# EAGLE design switch_hat_v3 (EAGLE 7.5.0)
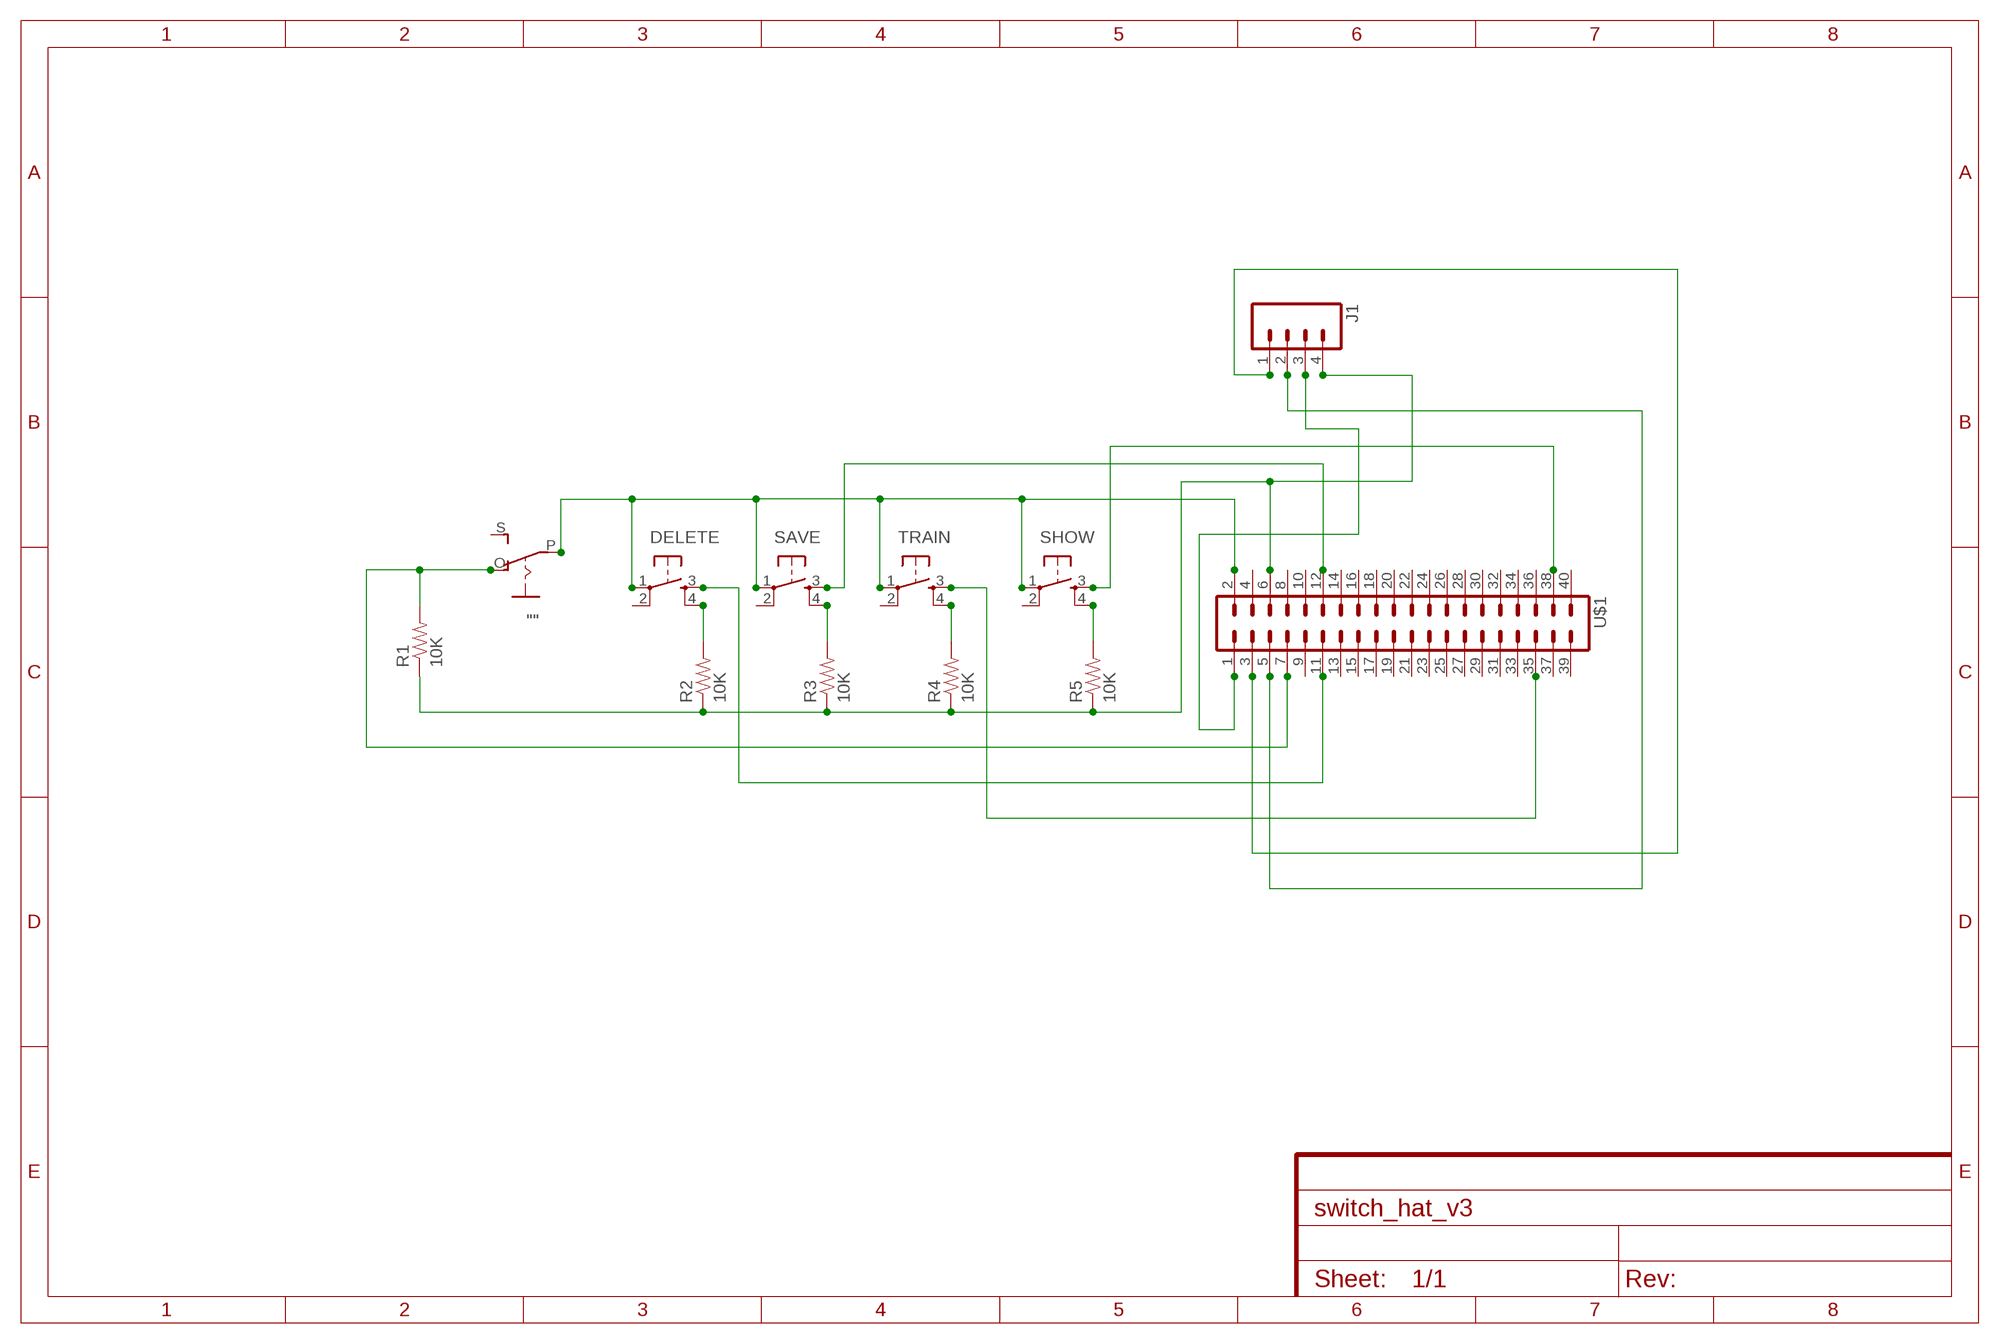
[diagram p0: schematic, sheet 1]

## Parts
""  EG1218S  [EG1218]
DELETE  TAC_SWITCHPTH  [TACTILE-PTH]
J1  M04LOCK  [1X04_LOCK]
R1  10K  RESISTOR0805-RES  [0805]
R2  10K  RESISTOR0805-RES  [0805]
R3  10K  RESISTOR0805-RES  [0805]
R4  10K  RESISTOR0805-RES  [0805]
R5  10K  RESISTOR0805-RES  [0805]
SAVE  TAC_SWITCHPTH  [TACTILE-PTH]
SHOW  TAC_SWITCHPTH  [TACTILE-PTH]
TRAIN  TAC_SWITCHPTH  [TACTILE-PTH]
U$1  PIZERO_THROUGH_HOLE  [PIZERO_THOUGH_HOLE]

## Nets
N$1: DELETE.4 R2.2
N$2: R3.2 SAVE.4
N$3: R4.2 TRAIN.4
N$4: R5.2 SHOW.4
N$5: J1.4 R1.1 R2.1 R3.1 R4.1 R5.1 U$1.6
N$6: DELETE.3 U$1.11
N$7: SAVE.3 U$1.12
N$8: J1.2 U$1.5
N$9: TRAIN.3 U$1.35
N$10: SHOW.3 U$1.38
N$11: J1.3 U$1.1
N$12: "".O R1.2 U$1.7
N$13: J1.1 U$1.3
VOLT: "".P DELETE.1 SAVE.1 SHOW.1 TRAIN.1 U$1.2
Unconnected: "".S DELETE.2 SAVE.2 SHOW.2 TRAIN.2 U$1.4 U$1.8 U$1.9 U$1.10 U$1.13 U$1.14 U$1.15 U$1.16 U$1.17 U$1.18 U$1.19 U$1.20 U$1.21 U$1.22 U$1.23 U$1.24 U$1.25 U$1.26 U$1.27 U$1.28 U$1.29 U$1.30 U$1.31 U$1.32 U$1.33 U$1.34 U$1.36 U$1.37 U$1.39 U$1.40

## Library data of the parts
"" = adafruit:EG1218: SLIDING SWITCH 0.1" spacing through hole, vertical SPDT slide switch http://www.ladyada.net/library/pcb/eaglelibrary.html
DELETE SAVE SHOW TRAIN = SparkFun-Retired:TAC_SWITCH: Momentary Switch Button commonly used for reset or general input. Spark Fun Electronics SKU : COM-00097 SMT- SWCH-08247
J1 = SparkFun-Connectors:M04: Header 4 Standard 4-pin 0.1" header. Use with straight break away headers (SKU : PRT-00116), right angle break away headers (PRT-00553), swiss pins (PRT-00743), machine pins (PRT-00117), and female headers (PRT-00115). Molex polarized connector foot print use with SKU : PRT-08231 with associated crimp pins and housings. 1MM SMD Version SKU: PRT-10208; PROD_ID: CONN-09696
R1-R5 = SparkFun-Passives:RESISTOR: Resistor Basic schematic elements and footprints for 0603, 1206, and PTH resistors.
U$1 = pizero:PIZERO_THROUGH_HOLE

## Board
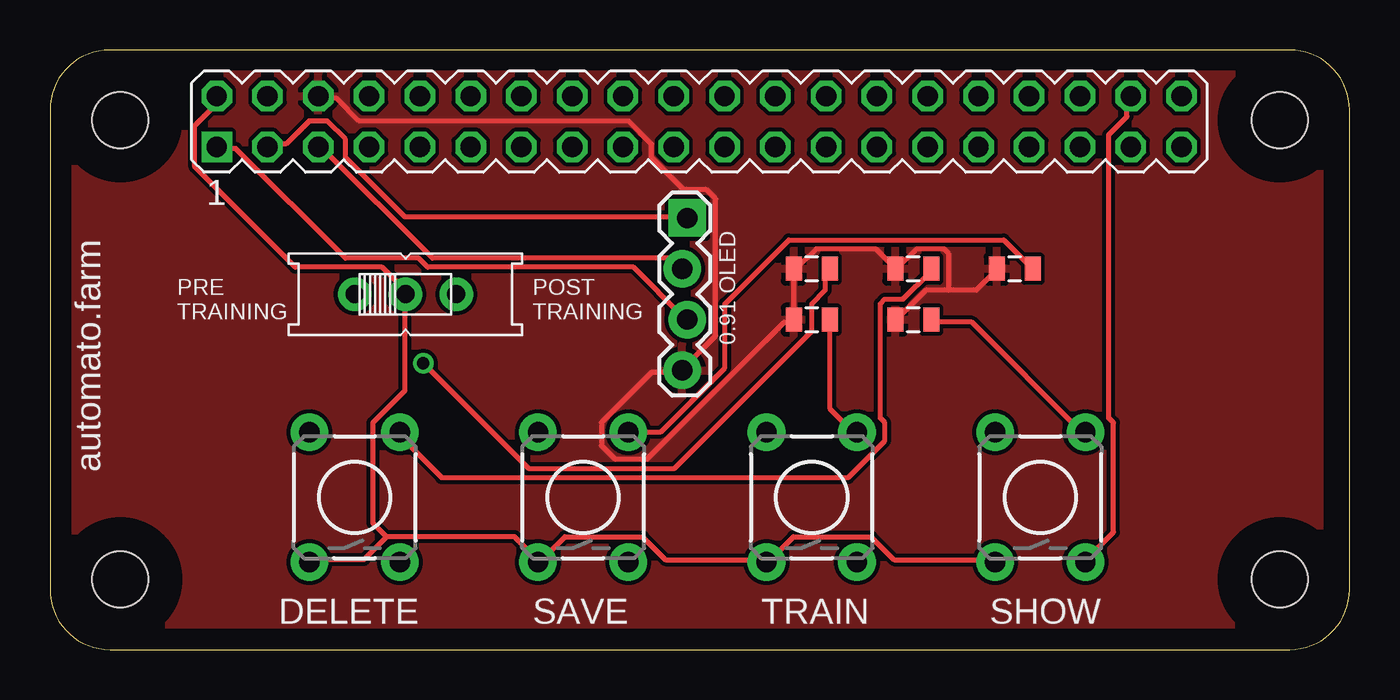
[diagram p1: board, top side]
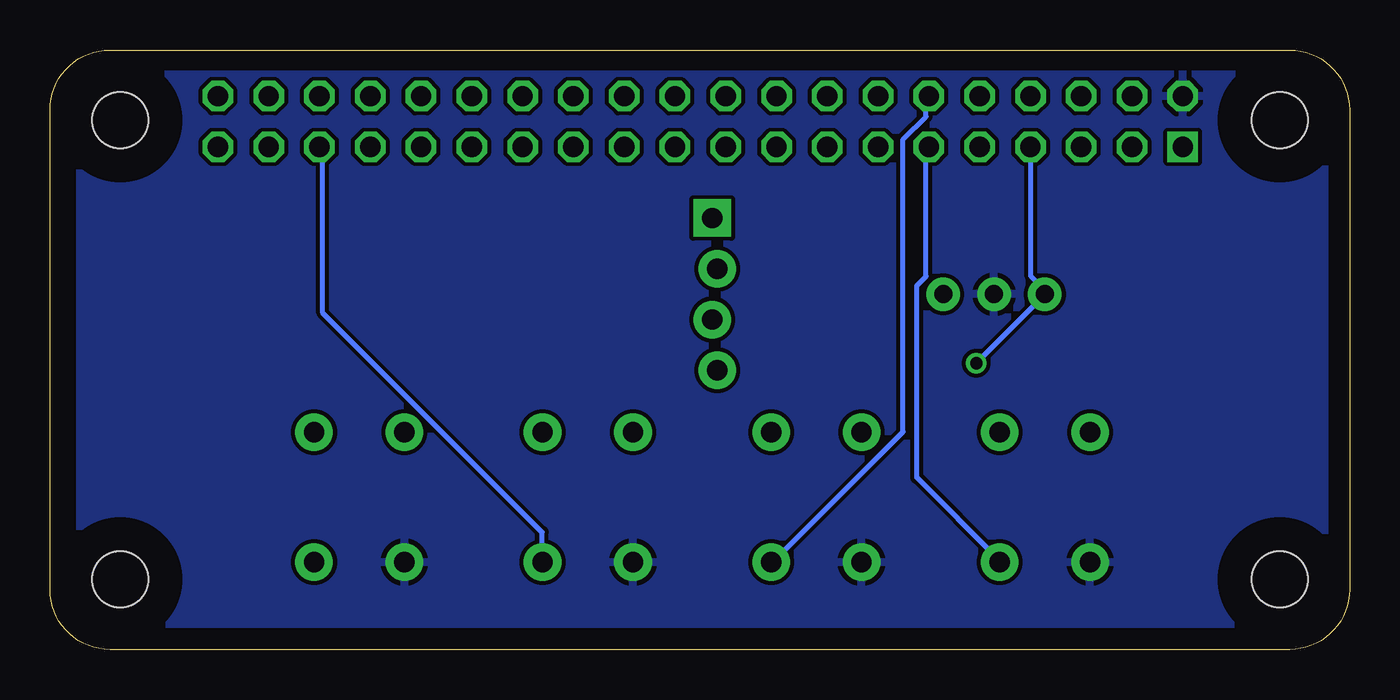
[diagram p2: board, bottom side, seen from below]

Size 65 x 30 mm. Coordinates in mm from the lower left corner, seen from the top.
Copper layers (1*16): Top 0.035mm / dielectric 1.5mm / Bottom 0.035mm
Design rules "default": minimum track width 10mil, minimum drill 24mil, track to track 8mil, track to pad 8mil, pad to pad 8mil, via to via 8mil, smd to smd 8mil, copper to edge 40mil, drill to drill 8mil, minimum pad ring 10mil, minimum via ring 8mil, stop-mask expansion 4mil, vias tented up to drill 0mil, thermal gap 10mil

### Footprints (pad centres in the part's own frame; a part is rotated, then mirrored left to right if it is on the bottom)
EG1218 = drill 0.9 pad 1.676: O -2.54,0; P 0,0; S 2.54,0
TACTILE-PTH = drill 1.016 pad 1.88: 1 -3.251,2.261; 2 3.251,2.261; 3 -3.251,-2.261; 4 3.251,-2.261
1X04_LOCK = drill 1.016 pad 1.88 square: 1 0,0.127 | drill 1.016 pad 1.88: 2 2.54,-0.127; 3 5.08,0.127; 4 7.62,-0.127
0805 = smd 0.8 x 1.2: 1 -0.9,0; 2 0.9,0
PIZERO_THOUGH_HOLE = drill 1.016 square: 1 8.34,25.15 | drill 1.016 octagon: 2 8.34,27.69; 3 10.88,25.15; 4 10.88,27.69; 5 13.42,25.15; 6 13.42,27.69; 7 15.96,25.15; 8 15.96,27.69; 9 18.5,25.15; 10 18.5,27.69; 11 21.04,25.15; 12 21.04,27.69; 13 23.58,25.15; 14 23.58,27.69; 15 26.12,25.15; 16 26.12,27.69; 17 28.66,25.15; 18 28.66,27.69; 19 31.2,25.15; 20 31.2,27.69; 21 33.74,25.15; 22 33.74,27.69; 23 36.28,25.15; 24 36.28,27.69; 25 38.82,25.15; 26 38.82,27.69; 27 41.36,25.15; 28 41.36,27.69; 29 43.9,25.15; 30 43.9,27.69; 31 46.44,25.15; 32 46.44,27.69; 33 48.98,25.15; 34 48.98,27.69; 35 51.52,25.15; 36 51.52,27.69; 37 54.06,25.15; 38 54.06,27.69; 39 56.6,25.15; 40 56.6,27.69 | hole 2.8: 3.5,3.5; 3.5,26.5; 61.5,26.5; 61.5,3.5

### Placement (x,y rotation side)
""  17.78,17.78 0 top
DELETE  15.24,7.62 90 top
J1  31.75,21.59 270 top
R1  38.1,19.05 0 top
R2  43.18,19.05 0 top
R3  48.26,19.05 0 top
R4  38.1,16.51 0 top
R5  43.18,16.51 0 top
SAVE  26.67,7.62 90 top
SHOW  49.53,7.62 90 top
TRAIN  38.1,7.62 90 top
U$1  0,0 0 top

### Tracks (layer width: path | path; a pad name or v marks a point on that pad's centre or on a via)
N$1
  Top 0.254: R2.2 44.04,18.9 42.67,17.53 41.76,17.53 41.53,17.3 41.53,11.58 41.76,11.35 41.76,10.44 39.93,8.61 19.58,8.61 17.53,10.67 DELETE.4
N$2
  Top 0.254: R3.2 49.07,19.13 47.7,20.5 36.96,20.5 33.76,17.3 33.76,14.1 30.56,10.9 28.96,10.9 SAVE.4
N$3
  Top 0.254: R4.2 39.01,16.38 39.01,12.04 40.16,10.9 TRAIN.4
N$4
  Top 0.254: R5.2 44.27,16.38 46.1,16.38 51.59,10.9 SHOW.4
N$5
  Top 0.254: 44.96,17.98 46.33,17.98 47.24,18.9 R3.1 | 44.96,17.98 43.82,17.98 42.44,16.61 R5.1 | 44.96,17.98 44.96,19.81 44.73,20.04 43.36,20.04 42.44,19.13 R2.1 42.22,19.13 41.3,20.04 38.33,20.04 37.41,19.13 R1.1 37.19,18.9 37.19,16.61 R4.1 37.19,16.38 36.73,16.38 29.87,9.52 28.27,9.52 27.58,10.21 27.58,11.35 30.1,13.87 31.47,13.87 J1.4 31.7,14.1 33.3,15.7 33.3,22.55 32.84,23.01 31.7,23.01 30.1,24.61 30.1,25.3 28.96,26.44 15.47,26.44 14.33,27.58 13.64,27.58 U$1.6
  pour Top: 1.27,27.94 1.27,1.27 63.5,1.27 63.5,29.21 1.27,29.21
N$6
  Bottom 0.254: U$1.11 21.18,25.07 21.18,18.67 21.64,18.21 21.64,8.61 17.53,4.5 DELETE.3
N$7
  Bottom 0.254: U$1.12 21.18,27.58 21.18,26.67 22.33,25.53 22.33,10.9 28.73,4.5 SAVE.3
N$8
  Top 0.254: U$1.5 13.64,25.07 19.13,19.58 31.01,19.58 31.47,19.13 J1.2
N$9
  Bottom 0.254: U$1.35 51.36,25.07 51.36,16.84 40.39,5.87 40.39,4.5 TRAIN.3
N$10
  Top 0.254: U$1.38 53.87,27.58 53.87,26.67 52.96,25.76 52.96,11.58 53.19,11.35 53.19,5.87 51.82,4.5 SHOW.3
N$11
  Top 0.254: U$1.1 8.38,25.07 9.3,25.07 14.78,19.58 18.44,19.58 18.9,19.13 29.18,19.13 31.7,16.61 J1.3
N$12  (via drill 0.61)
  Top 0.254: v18.67,14.33 23.93,9.07 31.24,9.07 38.1,15.93 38.1,17.3 38.79,17.98 38.79,18.9 R1.2
  Bottom 0.254: v18.67,14.33 15.24,17.75 "".O 15.24,17.98 15.93,18.67 15.93,25.07 U$1.7
N$13
  Top 0.254: U$1.3 10.9,25.3 11.81,25.3 12.95,26.44 13.87,26.44 14.78,25.53 14.78,24.61 17.75,21.64 31.7,21.64 J1.1
VOLT
  Top 0.254: U$1.2 8.15,27.58 8.15,27.13 7.24,26.21 7.24,24.15 12.27,19.13 16.61,19.13 17.75,17.98 "".P 17.75,17.75 17.75,12.95 16.15,11.35 16.15,6.33 16.84,5.64 | 16.84,5.64 15.7,4.5 13.18,4.5 DELETE.1 | 16.84,5.64 23.24,5.64 24.38,4.5 SAVE.1 24.61,4.5 25.76,5.64 29.64,5.64 30.79,4.5 35.81,4.5 TRAIN.1 36.04,4.5 37.19,5.64 41.07,5.64 42.22,4.5 47.24,4.5 SHOW.1
  pour Bottom: 1.27,27.94 1.27,1.27 63.5,1.27 63.5,29.21 1.27,29.21

### Text on the board
tNames: PRE / TRAINING | POST / TRAINING | 0.91 OLED | automato.farm | DELETE | SAVE | TRAIN | SHOW